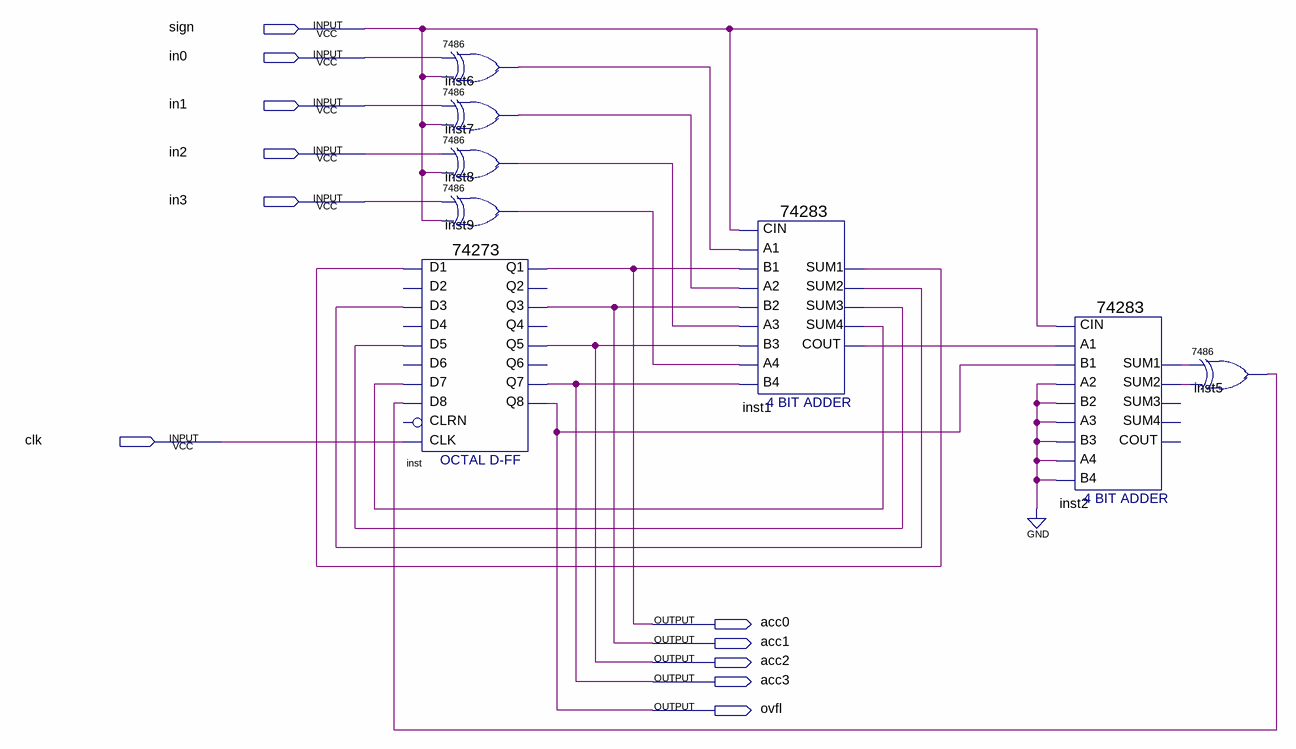
[diagram p0: schematic sheet]
// Quartus schematic exp10.bdf as structural Verilog: 8 symbols, 11 pins
module exp10 (
  input  sign,
  input  in0,
  input  in1,
  input  in2,
  input  in3,
  input  clk,
  output acc0,
  output acc1,
  output acc2,
  output acc3,
  output ovfl
);

  wire inst1_cout, inst1_sum1, inst1_sum2, inst1_sum3, inst1_sum4, inst2_sum1, inst2_sum2, inst5_1, inst6_1,
       inst7_1, inst8_1, inst9_1;

  \7486  inst6 (.\2 (in0), .\3 (sign), .\1 (inst6_1));
  \7486  inst7 (.\2 (in1), .\3 (sign), .\1 (inst7_1));
  \7486  inst8 (.\2 (in2), .\3 (sign), .\1 (inst8_1));
  \7486  inst9 (.\2 (in3), .\3 (sign), .\1 (inst9_1));
  \74273  inst (
    .D3(inst1_sum2), .D1(inst1_sum1), .D7(inst1_sum4), .D5(inst1_sum3), .D8(inst5_1), .CLK(clk), .Q1(acc0),
    .Q3(acc1), .Q5(acc2), .Q7(acc3), .Q8(ovfl));  // open: D2, D4, D6, CLRN, Q4, Q2, Q6
  \74283  inst1 (
    .CIN(sign), .A1(inst6_1), .A2(inst7_1), .B2(acc1), .A3(inst8_1), .A4(inst9_1), .B4(acc3), .B1(acc0),
    .B3(acc2), .SUM4(inst1_sum4), .COUT(inst1_cout), .SUM1(inst1_sum1), .SUM2(inst1_sum2), .SUM3(inst1_sum3));
  \74283  inst2 (
    .CIN(sign), .A1(inst1_cout), .A2(1'b0), .B2(1'b0), .A3(1'b0), .A4(1'b0), .B4(1'b0), .B1(ovfl), .B3(1'b0),
    .SUM1(inst2_sum1), .SUM2(inst2_sum2));  // open: SUM4, COUT, SUM3
  \7486  inst5 (.\2 (inst2_sum1), .\3 (inst2_sum2), .\1 (inst5_1));
endmodule
